# EAGLE board SM2000-A (EAGLE 6.5.0), part 1 of 2
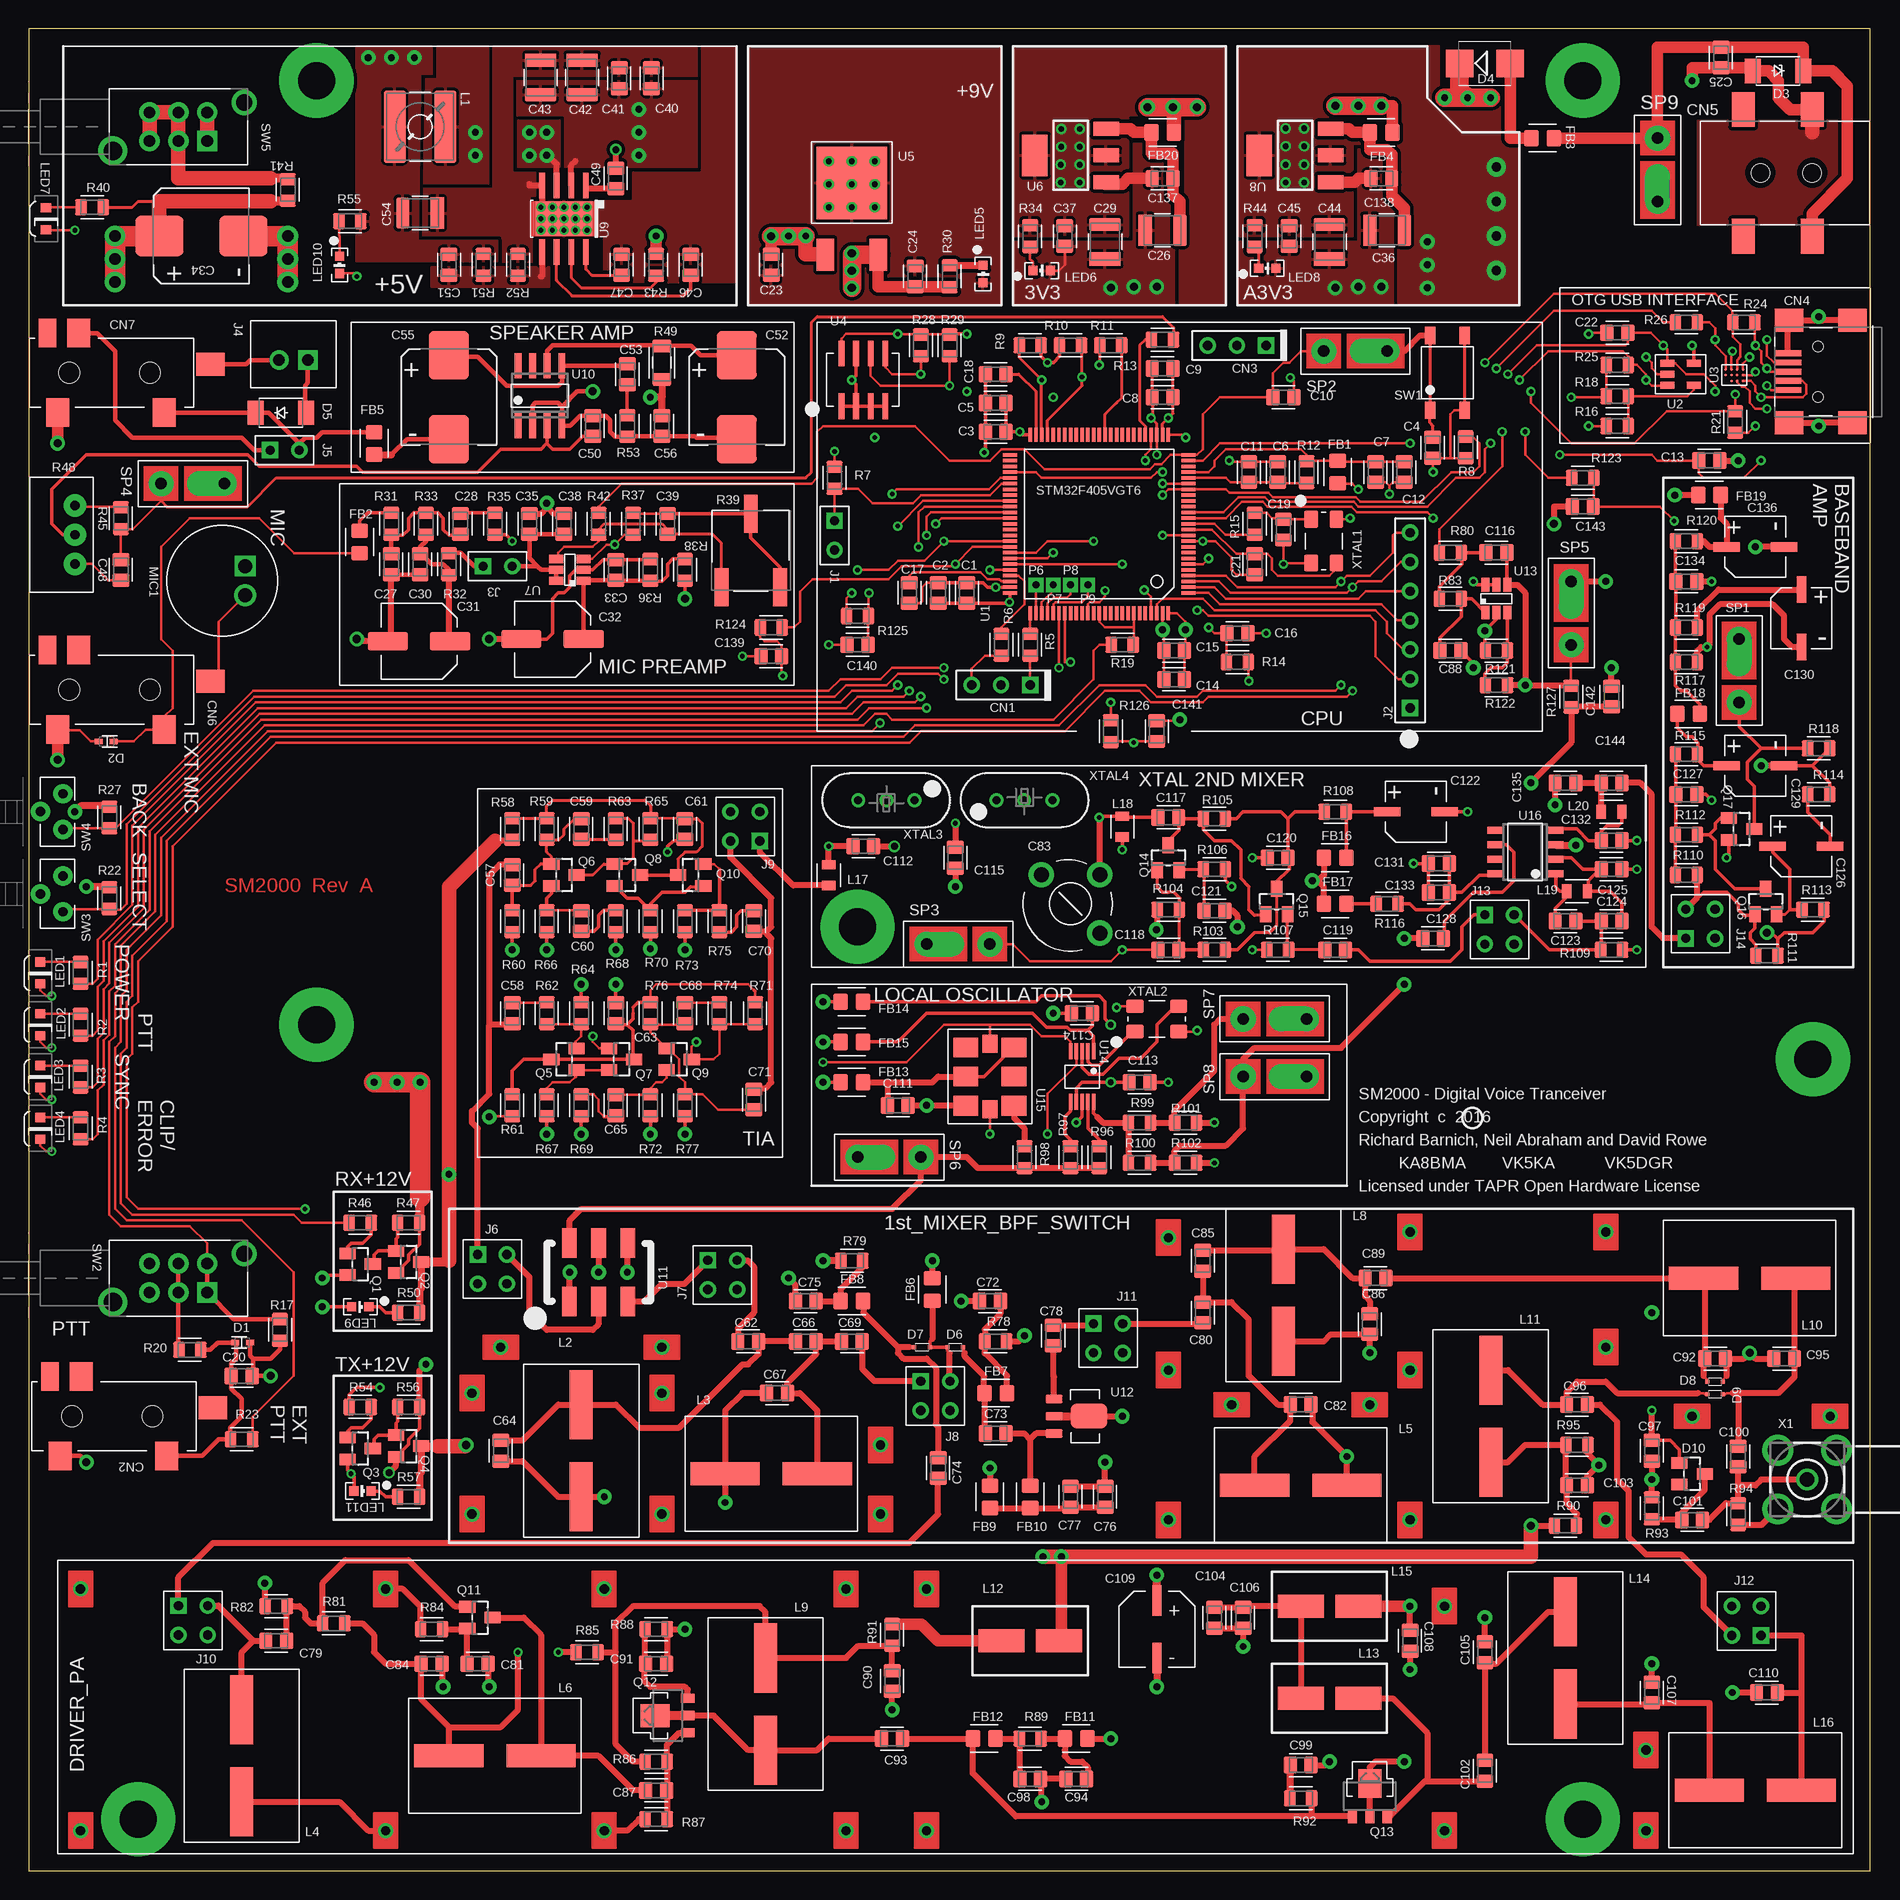
[diagram p7: board, top side]
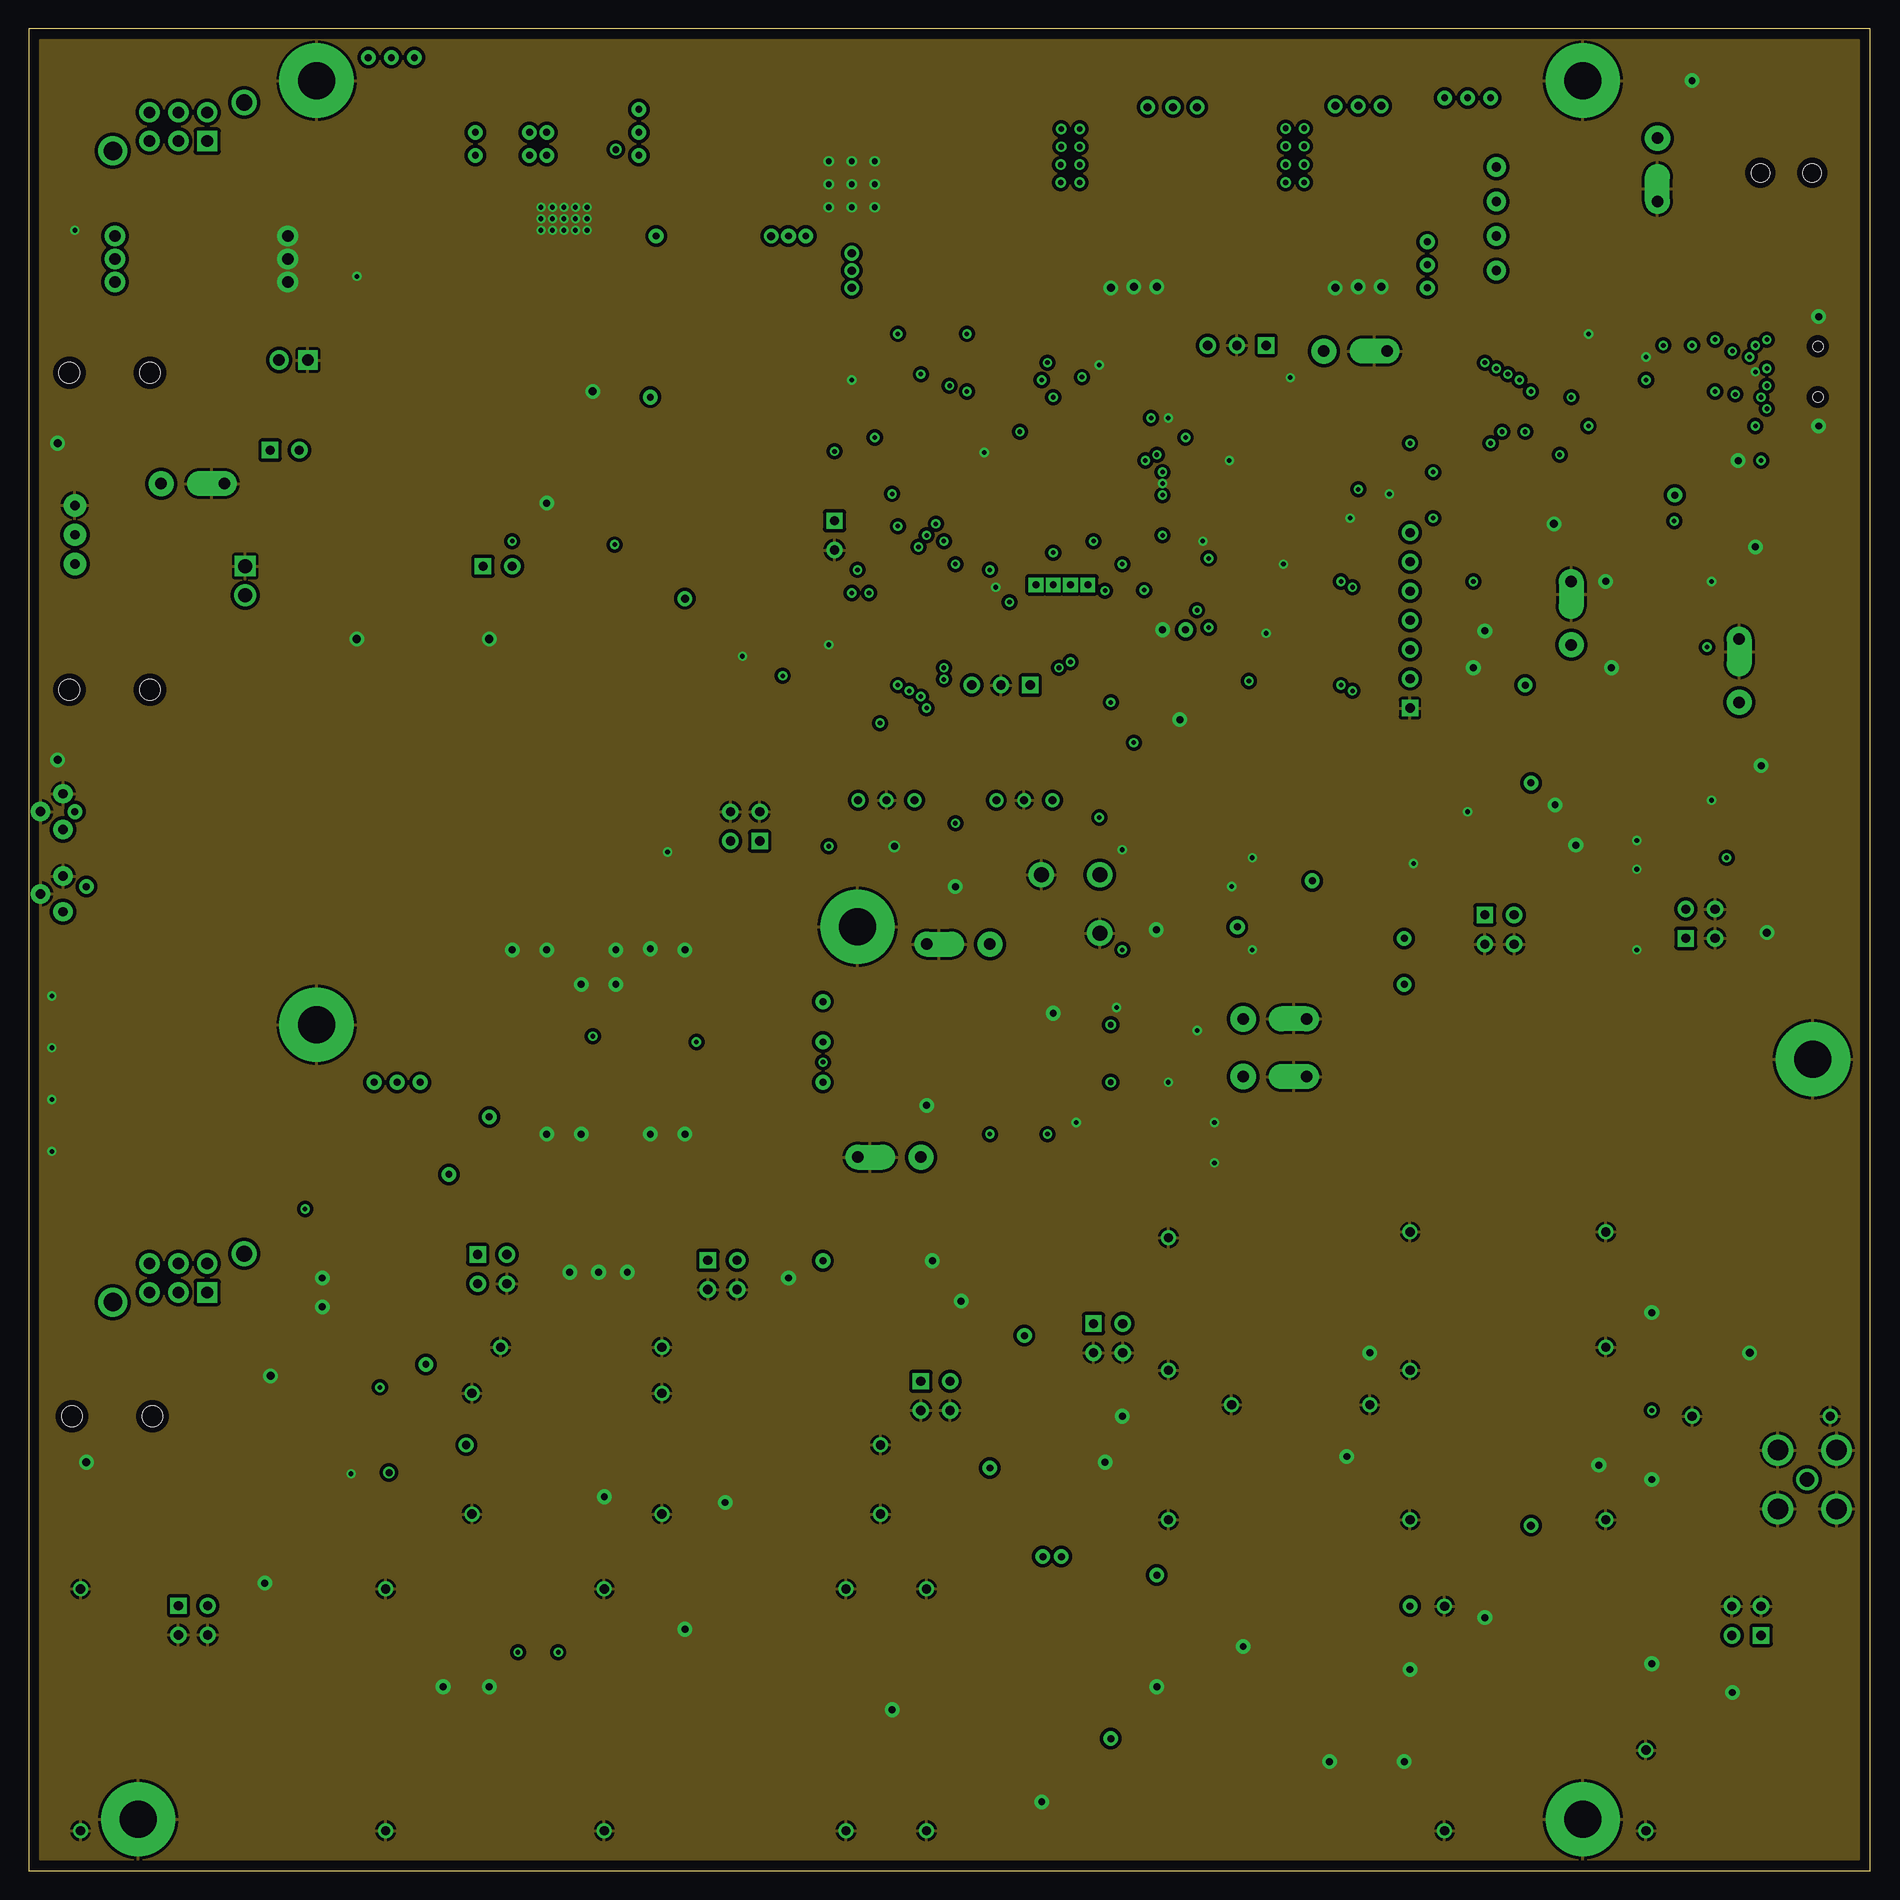
[diagram p8: board, inner layer L2-GND]
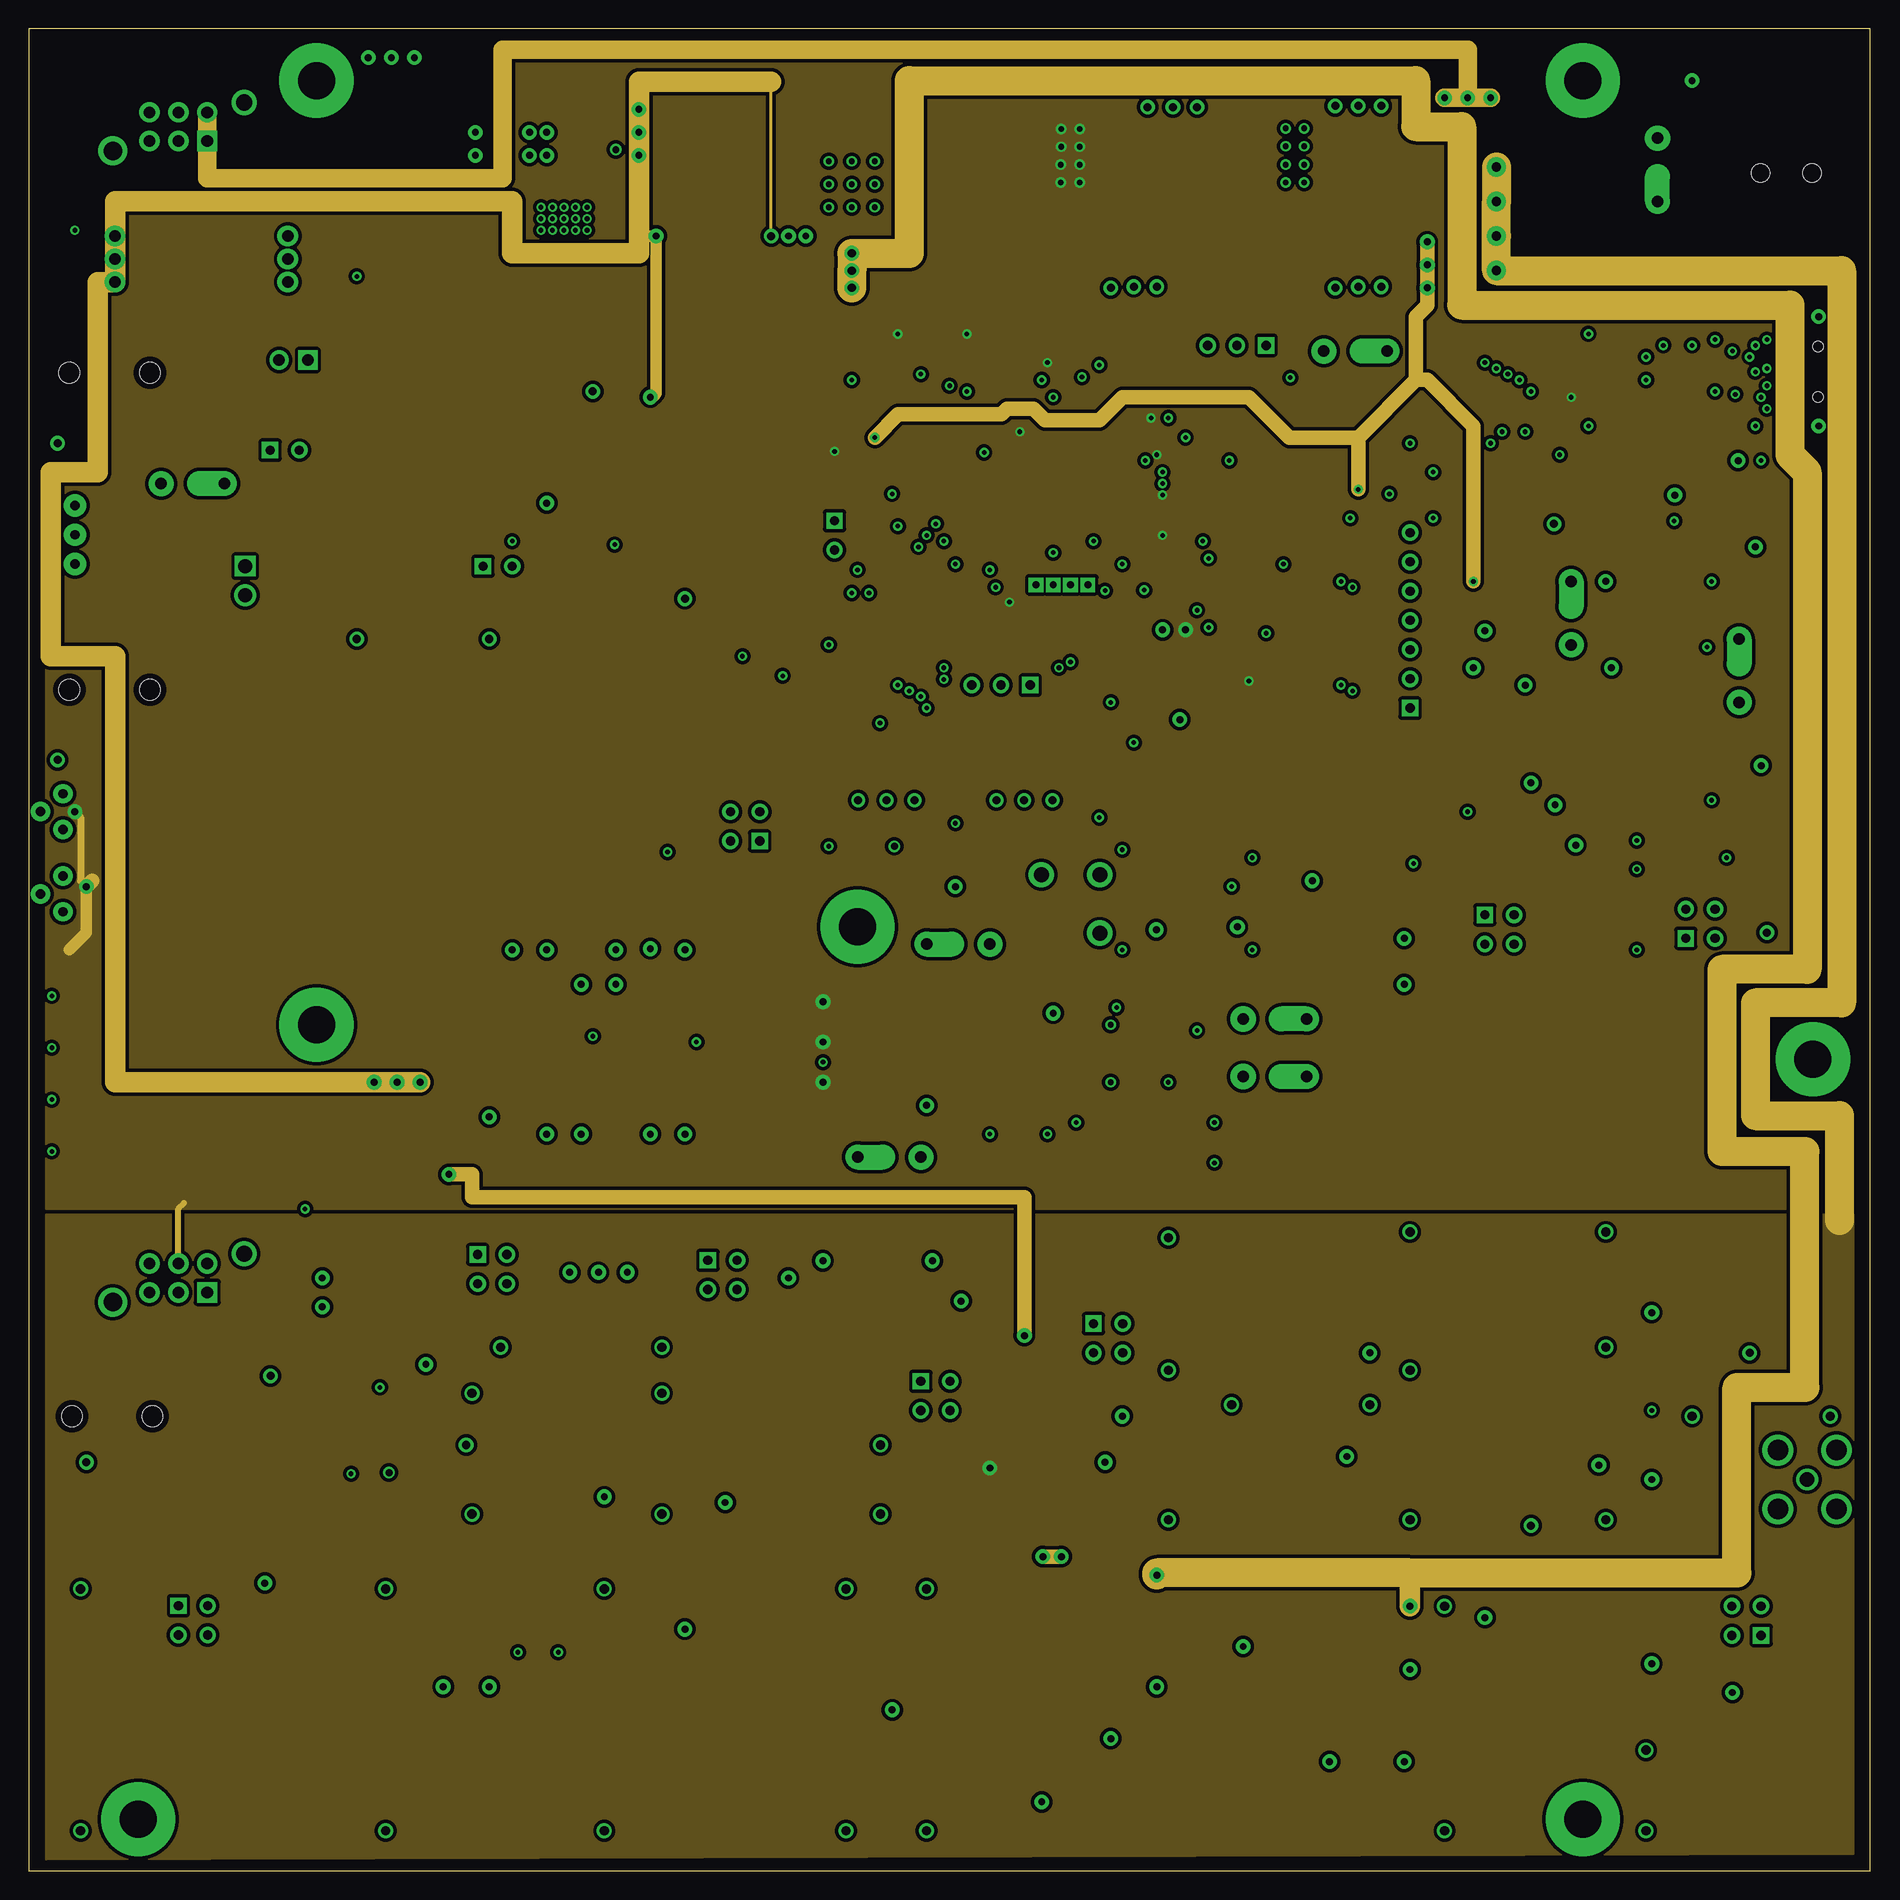
[diagram p9: board, inner layer L3-VDD]
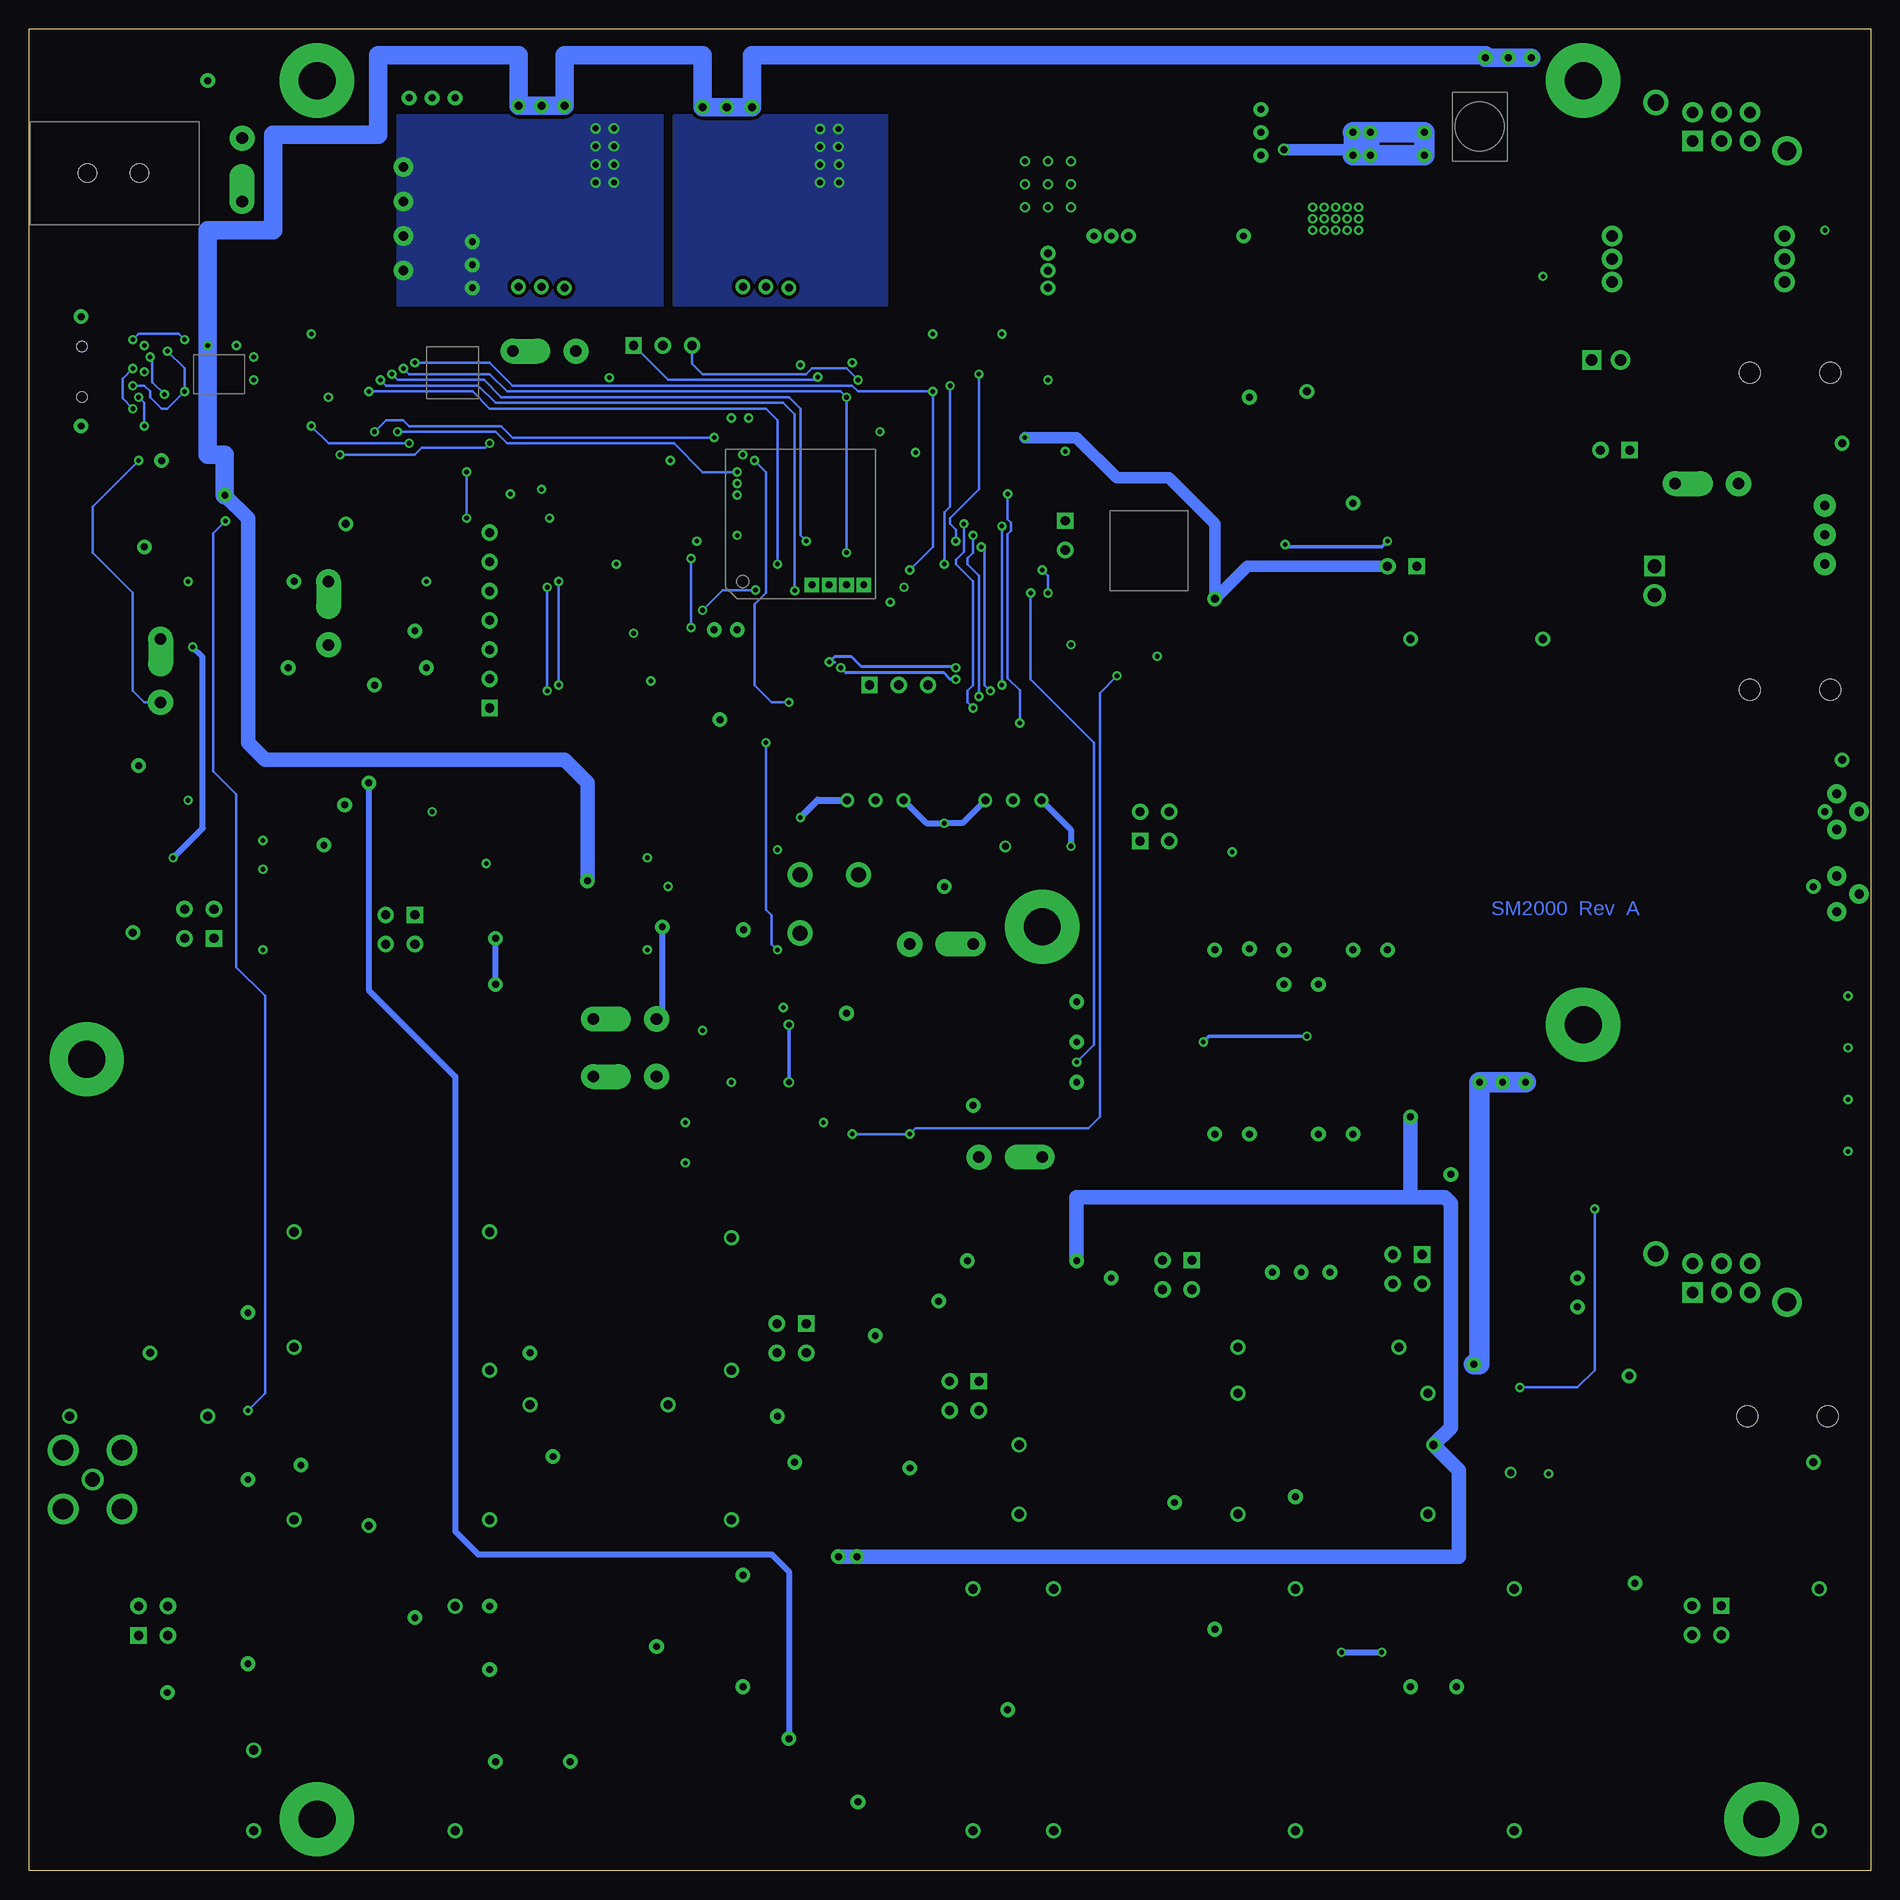
[diagram p10: board, bottom side, seen from below]

Size 160 x 160 mm. Coordinates in mm from the lower left corner, seen from the top.
Outline: 0,0 160,0 160,160 0,160 0,0
Copper layers (1*2+15*16): L1-TOP 0.035mm / dielectric 0.25mm / L2-GND 0.035mm / dielectric 1mm / L3-VDD 0.035mm / dielectric 0.25mm / L4-BOTTOM 0.035mm
Design rules "default *": minimum track width 0.2mm, minimum drill 0.4mm, track to track 0.2mm, track to pad 0.2mm, pad to pad 0.2mm, via to via 0.2mm, smd to smd 0.2mm, copper to edge 0.5mm, drill to drill 0.15mm, minimum pad ring 0.25mm, minimum via ring 0.2mm, stop-mask expansion 0.1mm, vias tented up to drill 0mil, thermal gap 0.25mm
Net classes: 1 Stripline: width 0.508 mm, drill 0.508 mm, clearance 0.508 mm

## Footprints (pad centres in the part's own frame; a part is rotated, then mirrored left to right if it is on the bottom)
C0805 = smd 1.15 x 1.45: 1 -0.9,0; 2 0.9,0
C1210 = smd 1.15 x 2.7: 1 -1.5,0; 2 1.5,0
NICHICON-WX-6.3 = smd 1.6 x 3.5: 1 0,2.7; 2 0,-2.7
CAP-CHEMI-HA0 = smd 3.5 x 4.2: 1 0,3.65; 2 0,-3.65
TRIMCAP_VAR_2222_V = drill 1.3 pad 2.184: R1 -2.54,2.54; R2 2.54,-2.54; S -2.54,-2.54
CAP-CHEMI-F80 = smd 0.8 x 2.65: 1 0,2.5; 2 0,-2.5
NICHICON-WJ-5 = smd 0.8 x 2.3: 1 0,2.5; 2 0,-2.5
HDR100-3 = drill 0.8 pad 1.422 square: 1 0,0 | drill 0.8 pad 1.422: 2 2.54,0; 3 5.08,0
ST-3509 = smd 2 x 2.5: A 4.75,3.45; B 2.95,-3.45; C -4.5,3.45 | smd 2.5 x 2: D -8.5,-0.75 | smd 1.5 x 2.5: F 5.65,-3.45 | hole 1.8: 3.75,0; -3.25,0
JI-MU3-002 = smd 0.5 x 2.3: 1 1.6,-2.85; 2 0.8,-2.85; 3 0,-2.85; 4 -0.8,-2.85; 5 -1.6,-2.85 | smd 2 x 2.5: 6 4.45,-2.75; 7 -4.45,-2.75; 8 4.45,2.75; 9 -4.45,2.75 | hole 0.9: -2.2,-0.25; 2.2,-0.25
DS-0518 = smd 2 x 3: 1 -3,5.5; 2 -3,-5.5; 3 3,-5.5; 4 3,5.5 | hole 1.6: -3,0; 1.5,0
SOD523 = smd 0.7 x 0.5: A 0.7,0; C -0.6,0
SOD128 = smd 1.4 x 2.1: A 2.2,0; C -2.2,0
SMB = smd 2.4 x 2.4: A 2.2,0; C -2.2,0
SC79_INFINEON = smd 0.35 x 0.35: A 0.675,0; C -0.675,0
SOT23 = smd 1 x 1.4: 1 -0.95,-1.1; 2 0.95,-1.1; 3 0,1.1
FE0805 = smd 1.28 x 1.47: 1 -0.975,0; 2 0.975,0
JMPR-2PIN = drill 0.8 pad 1.422 square: 1 0,1.27 | drill 0.8 pad 1.422: 2 0,-1.27
HDR100-7 = drill 0.8 pad 1.422 square: 1 0,0 | drill 0.8 pad 1.422: 2 2.54,0; 3 5.08,0; 4 7.62,0; 5 10.16,0; 6 12.7,0; 7 15.24,0
CONN-BOOM-XH-2A = drill 1 pad 1.676 square: 1 -1.25,0 | drill 1 pad 1.676: 2 1.25,0
JMPR-2X2X.1 = drill 0.8 pad 1.422 square: 1 2.54,0 | drill 0.8 pad 1.422: 2 2.54,-2.54; 3 0,0; 4 0,-2.54
SRR5028 = smd 1.9 x 6.3: 1 -2.2,0; 2 2.2,0
L10X15 = smd 2 x 6: 1 0,4; 2 0,-4
Z15/4 = smd 4 x 2: 1 -2.5,0; 2 2.5,0
L-TDK-MLF2012 = smd 1.2 x 0.8: P$1 0,0.9; P$2 0,-0.9
LTST-S2200K = smd 0.9 x 0.8: A 0,0.95; C 0,-0.95
SML-LX0603SRW = smd 0.8 x 0.8: A 0.75,0; C -0.75,0
CMA-4544PF-W = drill 1.2 pad 1.93: 1 -2,1.27 | drill 1.2 square: 2 -2,-1.27
TPAD50 = drill 0.6 pad 1.27 square: 1 0,0
MTG-PAD-3.2 = drill 3.2 pad 6.452: P$1 0,0
SOT89 = smd 0.8 x 1.2: 1 -1.499,-1.75; 2 0.001,-1.75; 3 1.499,-1.75 | smd 2 x 2.5: 4 0,1.1
R0805 = smd 1.05 x 1.4: 1 -0.95,0; 2 0.95,0
POT3361 = smd 1.19 x 3.3: 1 -2.54,-3.2; 2 0,3.2; 3 2.54,-3.2
POT-3310C = drill 0.8 pad 1.93: 1 -3.91,-2.54; 2 -3.91,0; 3 -3.91,2.54
R1206 = smd 1.1 x 1.7: 1 -1.45,0; 2 1.45,0
SGND = drill 0.8: 1 0,0
SCOPE_PAD = drill 1 pad 2.184: 1 0,1.5 | drill 1 pad 2.184 offset: 2 0,-4
TS-02B = smd 1.5 x 0.9: 1 -3.25,1.5; 2 3.25,1.5; 3 -3.25,-1.5; 4 3.25,-1.5
SW-LC2259 = drill 1 pad 1.778 square: 1 2.5,-1.25 | drill 1 pad 1.778: 2 0,-1.25; 3 -2.5,-1.25; 4 2.5,1.25; 5 0,1.25; 6 -2.5,1.25 | drill 1.6 pad 2.54: 7 -5.7,-2.1 | drill 1.4 pad 2.184: 8 5.7,2.1
TS-026 = drill 0.8 pad 1.676: 1 -1.55,-0.975; 2 1.55,-0.975; 3 0,0.975
LQFP100-14 = smd 0.3 x 1.2: 1 -6,-7.75; 2 -5.5,-7.75; 3 -5,-7.75; 4 -4.5,-7.75; 5 -4,-7.75; 6 -3.5,-7.75; 7 -3,-7.75; 8 -2.5,-7.75; 9 -2,-7.75; 10 -1.5,-7.75; 11 -1,-7.75; 12 -0.5,-7.75; 13 0,-7.75; 14 0.5,-7.75; 15 1,-7.75; 16 1.5,-7.75; 17 2,-7.75; 18 2.5,-7.75; 19 3,-7.75; 20 3.5,-7.75; 21 4,-7.75; 22 4.5,-7.75; 23 5,-7.75; 24 5.5,-7.75; 25 6,-7.75; 51 6,7.75; 52 5.5,7.75; 53 5,7.75; 54 4.5,7.75; 55 4,7.75; 56 3.5,7.75; 57 3,7.75; 58 2.5,7.75; 59 2,7.75; 60 1.5,7.75; 61 1,7.75; 62 0.5,7.75; 63 0,7.75; 64 -0.5,7.75; 65 -1,7.75; 66 -1.5,7.75; 67 -2,7.75; 68 -2.5,7.75; 69 -3,7.75; 70 -3.5,7.75; 71 -4,7.75; 72 -4.5,7.75; 73 -5,7.75; 74 -5.5,7.75; 75 -6,7.75 | smd 1.2 x 0.3: 26 7.75,-6; 27 7.75,-5.5; 28 7.75,-5; 29 7.75,-4.5; 30 7.75,-4; 31 7.75,-3.5; 32 7.75,-3; 33 7.75,-2.5; 34 7.75,-2; 35 7.75,-1.5; 36 7.75,-1; 37 7.75,-0.5; 38 7.75,0; 39 7.75,0.5; 40 7.75,1; 41 7.75,1.5; 42 7.75,2; 43 7.75,2.5; 44 7.75,3; 45 7.75,3.5; 46 7.75,4; 47 7.75,4.5; 48 7.75,5; 49 7.75,5.5; 50 7.75,6; 76 -7.75,6; 77 -7.75,5.5; 78 -7.75,5; 79 -7.75,4.5; 80 -7.75,4; 81 -7.75,3.5; 82 -7.75,3; 83 -7.75,2.5; 84 -7.75,2; 85 -7.75,1.5; 86 -7.75,1; 87 -7.75,0.5; 88 -7.75,0; 89 -7.75,-0.5; 90 -7.75,-1; 91 -7.75,-1.5; 92 -7.75,-2; 93 -7.75,-2.5; 94 -7.75,-3; 95 -7.75,-3.5; 96 -7.75,-4; 97 -7.75,-4.5; 98 -7.75,-5; 99 -7.75,-5.5; 100 -7.75,-6
SOT23-5L = smd 0.6 x 1.2: 1 0.95,1.15; 2 0,1.15; 3 -0.95,1.15; 4 -0.95,-1.15; 5 0.95,-1.15
ECOPACK-11 = smd 0.25 x 0.25: A2 0,0.75; A3 0.5,0.75; B1 -0.5,0.25; B2 0,0.25; B3 0.5,0.25; C1 -0.5,-0.25; C2 0,-0.25; C3 0.5,-0.25; D1 -0.5,-0.75; D2 0,-0.75; D3 0.5,-0.75
SOIC8 = smd 0.5 x 2.25: 1 -1.9,-2.3; 2 -0.63,-2.3; 3 0.64,-2.3; 4 1.91,-2.3; 5 1.91,2.3; 6 0.64,2.3; 7 -0.63,2.3; 8 -1.9,2.3
DPAK = smd 1.5 x 2.8: 1 -2.3,-3.125; 3 2.3,-3.125 | smd 6.1 x 6.3: 4 0,3.125
SOT223 = smd 1.219 x 2.235: 1 -2.311,-3.099; 2 0,-3.099; 3 2.311,-3.099 | smd 3.6 x 2.2: 4 0,3.099
SOT23-6 = smd 0.7 x 1.2: 1 -0.95,-1.2; 2 0,-1.2; 3 0.95,-1.2; 4 0.95,1.2; 5 0,1.2; 6 -0.95,1.2
PSO-DDA = smd 2.2 x 0.5: 1 -2.875,1.905; 2 -2.875,0.635; 3 -2.875,-0.635; 4 -2.875,-1.905; 5 2.875,-1.905; 6 2.875,-0.635; 7 2.875,0.635; 8 2.875,1.905 | smd 2.95 x 4.9: EP 0,0
SO08 = smd 0.6 x 2.2: 1 -1.905,-2.6; 2 -0.635,-2.6; 3 0.635,-2.6; 4 1.905,-2.6; 5 1.905,2.6; 6 0.635,2.6; 7 -0.635,2.6; 8 -1.905,2.6
ADE-1 = smd 1.27 x 2.54: 1 -2.54,-2.54; 2 0,-2.54; 3 2.54,-2.54; 4 2.54,2.54; 5 0,2.54; 6 -2.54,2.54
DF782 = smd 0.711 x 1.473: 1 -1.499,-1.918; 2 0,-1.918; 3 1.499,-1.918 | smd 2.159 x 3.175: 4 0,1.092
MSOP10 = smd 0.3 x 1.4: 1 -1,-2.2; 2 -0.5,-2.2; 3 0,-2.2; 4 0.5,-2.2; 5 1,-2.2; 6 1,2.2; 7 0.5,2.2; 8 0,2.2; 9 -0.5,2.2; 10 -1,2.2
SI570 = smd 1.7 x 2.15: 1 -2.54,-2.1; 2 0,-2.1; 3 2.54,-2.1; 4 2.54,2.1; 5 0,2.1; 6 -2.54,2.1 | smd 1.545 x 1.3: 7 -2.853,0; 8 2.853,0
SO-08 = smd 0.6 x 1.3: 1 -1.905,-2.65; 2 -0.635,-2.65; 3 0.635,-2.65; 4 1.905,-2.65; 5 1.905,2.65; 6 0.635,2.65; 7 -0.635,2.65; 8 -1.905,2.65
BU-SMA-H = drill 1.27: 1 0,0 | drill 1.778: 2 -2.55,2.55; 3 2.55,2.55; 4 2.55,-2.55; 5 -2.55,-2.55
CTS-405 = smd 1.5 x 1.2: 1 -1.9,-1.1; 2 1.9,-1.1; 3 1.9,1.1; 4 -1.9,1.1
HC49U = drill 0.7 pad 1.2: 1 -2.44,0; 2 -0.027,0; 3 2.44,0

## Placement (x,y rotation side)
C1  100nF,25V  [C0805]  81.5,111 90 top
C2  10nF,25V  [C0805]  79,111 90 top
C3  100nF,25V  [C0805]  84,125 180 top
C4  100nF,25V  [C0805]  121.96,123.61 90 top
C5  10nF,25V  [C0805]  84,127.5 180 top
C6  1uF,25V  [C0805]  108.5,121.5 90 top
C7  1uF,25V  [C0805]  117,121.5 270 top
C8  100nF,25V  [C0805]  98.5,128 0 top
C9  10nF,25V  [C0805]  98.5,130.5 0 top
C10  1nF,25V  [C0805]  109,128 0 top
C11  100nF,25V  [C0805]  106,121.5 90 top
C12  100nF,25V  [C0805]  119.5,121.5 270 top
C13  TBD  [C0805]  146,122.5 0 top
C14  100nF,25V  [C0805]  99.5,103.5 180 top
C15  10nF,25V  [C0805]  99.5,106 180 top
C16  1uF,25V  [C0805]  105,107.5 0 top
C17  2.2uF,25V  [C0805]  76.5,111 270 top
C18  2.2uF,25V  [C0805]  84,130 180 top
C19  20pF,50V  [C0805]  109,116.5 270 top
C20  100nF,25V  [C0805]  18.5,43 0 top
C21  20pF,50V  [C0805]  106.5,113.5 270 top
C22  4.7uF,25V  [C0805]  138,133.6 180 top
C23  .33uF,25V  [C0805]  64.5,139.5 270 top
C24  100nF,25V  [C0805]  77,138.5 90 top
C25  10nF,25V  [C0805]  147,157.5 270 top
C26  22uF,25V  [C1210]  98.5,142.5 180 top
C27  1nF,25V  [C0805]  31.5,113.5 270 top
C28  220nF,25V  [C0805]  37.5,117 90 top
C29  22uF,25V  [C1210]  93.5,141.5 270 top
C30  100nF,25V  [C0805]  34,113.5 270 top
C31  100uF,6.3V,EL  [NICHICON-WX-6.3]  33.91,106.81 270 top
C32  100uF,6.3V,EL  [NICHICON-WX-6.3]  45.5,107 270 top
C33  100nF,25V  [C0805]  51,113 270 top
C34  220uF,25V  [CAP-CHEMI-HA0]  15,142 90 top
C35  100nF,25V  [C0805]  43.5,117 90 top
C36  22uF,25V  [C1210]  118,142.5 180 top
C37  100nF,25V  [C0805]  90,142 270 top
C38  2.2uF,25V  [C0805]  46.5,117 90 top
C39  100pF,50V  [C0805]  55.5,117 270 top
C40  1nF,25V  [C0805]  54.1,155.7 90 top
C41  100nF,25V  [C0805]  51.3,155.7 90 top
C42  22uF,25V  [C1210]  48.07,155.77 90 top
C43  22uF,25V  [C1210]  44.47,155.77 90 top
C44  22uF,25V  [C1210]  113,141.5 270 top
C45  100nF,25V  [C0805]  109.5,142 270 top
C46  470nF,25V  [C0805]  57.5,139.5 90 top
C47  8.2nF,25V  [C0805]  51.5,139.5 90 top
C48  100nF,25V  [C0805]  8,113 270 top
C49  100nF,25V  [C0805]  51,147 90 top
C50  3.9nF,25V  [C0805]  49,125.5 90 top
C51  20pF,50V  [C0805]  36.5,139.5 270 top
C52  220uF,25V  [CAP-CHEMI-HA0]  61.5,128 0 top
C53  47nF,25V  [C0805]  52,130 270 top
C54  22uF,25V  [C1210]  34,144 0 top
C55  220uF,25V  [CAP-CHEMI-HA0]  36.5,128 0 top
C56  100nF,25V  [C0805]  55,125.5 270 top
C57  100nF,25V  [C0805]  42,86.5 90 top
C58  100nF,25V  [C0805]  42,74.5 90 top
C59  100nF,25V  [C0805]  48,90.5 90 top
C60  100nF,25V  [C0805]  48,82.5 270 top
C61  100nF,25V  [C0805]  57,90.5 270 top
C62  3.3pF,50V  [C0805]  62.5,46 180 top
C63  100nF,25V  [C0805]  51,74.5 90 top
C64  12pF,50V  [C0805]  41,36.5 270 top
C65  100nF,25V  [C0805]  51,66.5 270 top
C66  0.5pF,50V  [C0805]  67.5,46 180 top
C67  12pF,50V  [C0805]  65,41.5 0 top
C68  100nF,25V  [C0805]  57,74.5 270 top
C69  3.3pF,50V  [C0805]  71.5,46 180 top
C70  100nF,25V  [C0805]  63,82.5 90 top
C71  100nF,25V  [C0805]  63,67 90 top
C72  1nF,25V  [C0805]  83.5,49.5 180 top
C73  1nF,25V  [C0805]  84,38 0 top
C74  1nF,25V  [C0805]  79,35 270 top
C75  1nF,25V  [C0805]  67.5,49.5 180 top
C76  1nF,25V  [C0805]  93.5,32.5 90 top
C77  1uF,25V  [C0805]  90.5,32.5 90 top
C78  1nF,25V  [C0805]  89,46.5 90 top
C79  22pF,50V  [C0805]  21.5,20 180 top
C80  3.3pF,50V  [C0805]  102,48.5 270 top
C81  1nF,25V  [C0805]  39,18 0 top
C82  12pF,50V  [C0805]  110.5,40.5 0 top
C83  2-12pF  [TRIMCAP_VAR_2222_V]  90.5,84 180 top
C84  100nF,25V  [C0805]  35,18 0 top
C85  0.5pF,50V  [C0805]  102,53 270 top
C86  12pF,50V  [C0805]  116.5,47.5 90 top
C87  5.6pF,50V  [C0805]  54.5,7 180 top
C88  8.2nF,25V  [C0805]  123.5,106 0 top
C89  3.3pF,50V  [C0805]  117,51.5 180 top
C90  100nF,25V  [C0805]  75,16.5 270 top
C91  1nF,25V  [C0805]  54.5,18 0 top
C92  22pF,50V  [C0805]  146.5,44.5 0 top
C93  22pF,50V  [C0805]  75,11.5 180 top
C94  100nF,25V  [C0805]  91,8 180 top
C95  22pF,50V  [C0805]  152.5,44.5 180 top
C96  1nF,25V  [C0805]  134.5,40.5 0 top
C97  1nF,25V  [C0805]  141,36.5 90 top
C98  1nF,25V  [C0805]  87,8 0 top
C99  1nF,25V,DNL  [C0805]  110.5,9.2 0 top
C100  1nF,25V  [C0805]  148.5,36 90 top
C101  1pF,50V  [C0805]  144.5,30.5 0 top
C102  1nF,25V  [C0805]  126.5,8.7 90 top
C103  1nF,25V  [C0805]  134.5,33.5 0 top
C104  100nF,25V  [C0805]  103,22 270 top
C105  33pF,50V  [C0805]  126.5,19 90 top
C106  1nF,25V  [C0805]  105.5,22 270 top
C107  47pF,50V  [C0805]  141,15.5 90 top
C108  100nF,25V  [C0805]  120,20 270 top
C109  100uF,25V,EL  [CAP-CHEMI-F80]  98,21 0 top
C110  33pF,50V  [C0805]  151,15.5 180 top
C111  100nF,25V  [C0805]  75.5,66.5 0 top
C112  39pF,50V  [C0805]  72.5,89 0 top
C113  100nF,25V  [C0805]  96.5,68.5 0 top
C114  100nF,25V  [C0805]  91.5,74.5 180 top
C115  5.6pF,50V  [C0805]  80.5,88 270 top
C116  8.2nF,25V  [C0805]  127.5,114.5 0 top
C117  100nF,25V  [C0805]  99,91.5 0 top
C118  100nF,25V  [C0805]  99,80 180 top
C119  100nF,25V  [C0805]  113.5,80 0 top
C120  100nF,25V  [C0805]  108.5,88 180 top
C121  100nF,25V  [C0805]  103,83.4 0 top
C122  10uF,25V,EL  [NICHICON-WJ-5]  120.5,92 90 top
C123  27pF,50V  [C0805]  133.5,82.5 180 top
C124  150pF,50V  [C0805]  137.5,82.5 180 top
C125  100nF,25V  [C0805]  137.5,87 180 top
C126  10uF,25V,EL  [NICHICON-WJ-5]  154,89 90 top
C127  100nF,25V  [C0805]  144,93.5 0 top
C128  150pF,50V  [C0805]  122,81 0 top
C129  10uF,25V,EL  [NICHICON-WJ-5]  150,96 90 top
C130  10uF,25V,EL  [NICHICON-WJ-5]  154,108.8 0 top
C131  1nF,25V  [C0805]  122.5,87.5 0 top
C132  1nF,25V  [C0805]  137.5,89.5 180 top
C133  100nF,25V  [C0805]  122.5,85 0 top
C134  100nF,25V  [C0805]  144,112 0 top
C135  1nF,25V  [C0805]  133.5,94.5 0 top
C136  10uF,25V,EL  [NICHICON-WJ-5]  150,115 90 top
C137  100nF,25V  [C0805]  98.5,147 180 top
C138  100nF,25V  [C0805]  117.5,147 180 top
C139  TBD  [C0805]  64.5,105.5 180 top
C140  TBD  [C0805]  72,106.5 180 top
C141  TBD  [C0805]  98,99 90 top
C142  TBD  [C0805]  137.5,102 90 top
C143  TBD  [C0805]  135,118.5 180 top
C144  100nF,25V  [C0805]  137.5,94.5 180 top
CN1  HDR100-3  [HDR100-3]  87,103 180 top
CN2  ST-3509  [ST-3509]  7.5,39.5 180 top
CN3  HDR100-3  [HDR100-3]  107.5,132.5 180 top
CN4  JS-MU3-002  [JI-MU3-002]  155.68,130.22 270 top
CN5  DS-0518  [DS-0518]  151.93,147.48 180 top
CN6  ST-3509  [ST-3509]  7.28,102.59 180 top
CN7  ST-3509  [ST-3509]  7.28,130.12 180 top
D1  DNL  [SOD523]  18.54,45.9 0 top
D2  DNL  [SOD523]  6.77,98.1 180 top
D3  PTVS20VP1UP  [SOD128]  151.97,156.34 180 top
D4  B330B  [SMB]  126.5,157 0 top
D5  DNL  [SOD128]  21.91,126.66 0 top
D6  BAR64-02V  [SC79_INFINEON]  80.5,45.5 0 top
D7  BAR64-02V  [SC79_INFINEON]  77.6,45.5 180 top
D8  BAR64-02V  [SC79_INFINEON]  146.5,42.5 180 top
D9  BAR64-02V  [SC79_INFINEON]  146.5,41.4 180 top
D10  BAT18  [SOT23]  144.5,34.5 270 top
DRILEGEND  [DRILEGEND]  19.31,-33.33 0 top  (outside the outline)
FB1  FB0805  [FE0805]  113.7,121.5 90 top
FB2  FB0805  [FE0805]  28.75,115.43 90 top
FB3  FB0805  [FE0805]  131.5,150.5 180 top
FB4  FB0805  [FE0805]  117.5,151 180 top
FB5  FB0805  [FE0805]  30,124 90 top
FB6  FB0805  [FE0805]  78.5,50.5 270 top
FB7  FB0805  [FE0805]  84,41.5 0 top
FB8  FB0805  [FE0805]  71.5,49.5 0 top
FB9  FB0805  [FE0805]  83.5,32.5 90 top
FB10  FB0805  [FE0805]  87,32.5 270 top
FB11  FB0805  [FE0805]  91,11.5 180 top
FB12  FB0805  [FE0805]  83,11.5 180 top
FB13  FB0805  [FE0805]  71.5,68.5 0 top
FB14  FB0805  [FE0805]  71.5,75.5 0 top
FB15  FB0805  [FE0805]  71.5,72 0 top
FB16  FB0805  [FE0805]  113.5,88 180 top
FB17  FB0805  [FE0805]  113.5,84 0 top
FB18  FB0805  [FE0805]  144.2,100.5 0 top
FB19  FB0805  [FE0805]  146,119.5 180 top
FB20  FB0805  [FE0805]  98.5,151 180 top
J1  JMP-2PIN  [JMPR-2PIN]  70,116 0 top
J2  HDR100-7  [HDR100-7]  120,101 90 top
J3  JMP-2PIN  [JMPR-2PIN]  40.73,113.32 90 top
J4  CONN-BOOM-XH-2A  [CONN-BOOM-XH-2A]  23,131.23 180 top
J5  JMP-2PIN  [JMPR-2PIN]  22.23,123.4 90 top
J6  JMPR-2X2  [JMPR-2X2X.1]  39,51 90 top
J7  JMPR-2X2  [JMPR-2X2X.1]  59,50.5 90 top
J8  JMPR-2X2  [JMPR-2X2X.1]  77.5,40 90 top
J9  JMPR-2X2  [JMPR-2X2X.1]  63.5,92 270 top
J10  JMPR-2X2  [JMPR-2X2X.1]  13,20.5 90 top
J11  JMPR-2X2  [JMPR-2X2X.1]  92.5,45 90 top
J12  JMPR-2X2  [JMPR-2X2X.1]  150.5,23 270 top
J13  JMPR-2X2  [JMPR-2X2X.1]  126.5,80.5 90 top
J14  JMPR-2X2  [JMPR-2X2X.1]  146.5,81 180 top
L1  4.2uH  [SRR5028]  34,151.5 180 top
L2  68nH  [L10X15]  48,36.5 0 top
L3  68nH  [L10X15]  64.5,34.5 270 top
L4  57nH  [L10X15]  18.5,10 0 top
L5  68nH  [L10X15]  110.5,33.5 90 top
L6  168nH  [L10X15]  40.5,10 90 top
L8  68nH  [L10X15]  109,50 0 top
L9  54nH  [L10X15]  64,14.5 0 top
L10  53nH 3T 5mm ID  [L10X15]  149.5,51.5 90 top
L11  220nH  [L10X15]  127,39.5 180 top
L12  RFC  [Z15/4]  87,20 180 top
L13  RFC  [Z15/4]  113,15 0 top
L14  57nH  [L10X15]  133.5,18.5 0 top
L15  RFC  [Z15/4]  113,23 0 top
L16  57nH  [L10X15]  150,7 90 top
L17  5.7uH  [L-TDK-MLF2012]  69.5,86.5 180 top
L18  L-TDK-MLF-2012-9.2uH  [L-TDK-MLF2012]  95,90.7 0 top
L19  5.2uH  [L-TDK-MLF2012]  134.5,85.1 90 top
L20  15uH,TDK,MLF  [L-TDK-MLF2012]  137.5,92 270 top
LED1  LTST-S220KGKT  [LTST-S2200K]  1,78 0 top
LED2  LTST-S220KRKT  [LTST-S2200K]  1,73.5 0 top
LED3  LTST-S220KGKT  [LTST-S2200K]  1,69 0 top
LED4  LTST-S220KRKT  [LTST-S2200K]  1,64.5 0 top
LED5  SML-LX0603GW  [SML-LX0603SRW]  82.9,138.7 90 top
LED6  SML-LX0603GW  [SML-LX0603SRW]  88,139 180 top
LED7  LTST-S220KGKT  [LTST-S2200K]  1.5,143.5 0 top
LED8  SML-LX0603GW  [SML-LX0603SRW]  107.6,139.2 180 top
LED9  SML-LX0603SRW  [SML-LX0603SRW]  28.8,49 0 top
LED10  SML-LX0603GW  [SML-LX0603SRW]  27,139.5 90 top
LED11  SML-LX0603YW  [SML-LX0603SRW]  29,33 0 top
MIC1  CMA-4544PF-W  [CMA-4544PF-W]  16.8,112.06 180 top
P6  TPAD50  [TPAD50]  87.5,111.7 0 top
P7  TPAD50  [TPAD50]  89,111.7 0 top
P8  TPAD50  [TPAD50]  90.5,111.7 0 top
P9  TPAD50  [TPAD50]  92,111.7 0 top
PAD1  MTG-PAD-3.2  [MTG-PAD-3.2]  25,155.5 0 top
PAD2  MTG-PAD-3.2  [MTG-PAD-3.2]  135,155.5 0 top
PAD3  MTG-PAD-3.2  [MTG-PAD-3.2]  25,73.5 0 top
PAD4  MTG-PAD-3.2  [MTG-PAD-3.2]  72,82 0 top
PAD5  MTG-PAD-3.2  [MTG-PAD-3.2]  155,70.5 0 top
PAD6  MTG-PAD-3.2  [MTG-PAD-3.2]  9.5,4.5 0 top
PAD7  MTG-PAD-3.2  [MTG-PAD-3.2]  135,4.5 0 top
PCB1  SM2000A  [NOPACKAGE]  -1,1 0 top
Q1  MMBT3904  [SOT23]  28.8,52.7 270 top
Q2  STR2P3LLH6  [SOT23]  33,52.9 270 top
Q3  MMBT3904  [SOT23]  28.8,36.7 270 top
Q4  STR2P3LLH6  [SOT23]  33,36.9 270 top
Q5  MMBT3904  [SOT23]  46.5,70.5 90 top
Q6  MMBT3904  [SOT23]  46.5,86.5 270 top
Q7  MMBT3904  [SOT23]  51.5,70.5 270 top
Q8  MMBT3904  [SOT23]  52,86.5 270 top
Q9  MMBT3904  [SOT23]  56.5,70.5 270 top
Q10  MMBT3904  [SOT23]  57.5,86.5 90 top
Q11  BFR92  [SOT23]  39.2,22 270 top
Q12  BFQ19  [SOT89]  55.5,13.5 90 top
Q13  RD01MUS2  [SOT89]  116.5,6.5 0 top
Q14  MMBT3904  [SOT23]  99,88 0 top
Q15  MMBT3904  [SOT23]  108.4,84.2 0 top
Q16  MMBT3904  [SOT23]  150.9,84.2 0 top
Q17  MMBT3906  [SOT23]  148.8,90.5 270 top
R1  680,1%  [R0805]  4.5,78 90 top
R2  680,1%  [R0805]  4.5,73.5 90 top
R3  680,1%  [R0805]  4.5,69 90 top
R4  680,1%  [R0805]  4.5,64.5 90 top
R5  22,1%  [R0805]  87,106.5 270 top
R6  22,1%  [R0805]  84.5,106.5 270 top
R7  4.7K,1%  [R0805]  70,121 270 top
R8  4.7K,1%  [R0805]  124.83,123.64 270 top
R9  4.7K,1%  [R0805]  87,132.5 180 top
R10  4.7K,1%  [R0805]  90.5,132.5 0 top
R11  1K,1%  [R0805]  94,132.5 0 top
R12  47,1%  [R0805]  111,121.5 270 top
R13  0 Ohm  [R0805]  98.5,133 0 top
R14  0 Ohm  [R0805]  105,105 180 top
R15  220,1%  [R0805]  106.5,117 90 top
R16  0 Ohm  [R0805]  138,125.5 0 top
R17  10K,1%  [R0805]  21.82,46.99 90 top
R18  10K,1%  [R0805]  138,128.1 180 top
R19  470,1%  [R0805]  95,106.5 180 top
R20  10K,1%  [R0805]  14,45.26 0 top
R21  22,1%  [R0805]  148.24,125.85 90 top
R22  10K,1%  [R0805]  7,84.5 90 top
R23  2.2K,1%  [R0805]  18.5,37.5 0 top
R24  22,1%  [R0805]  149,134.5 180 top
R25  47K,1%  [R0805]  138,130.8 0 top
R26  0 Ohm  [R0805]  144,134.5 180 top
R27  10K,1%  [R0805]  7,91.5 90 top
R28  4.7K,1%  [R0805]  77.5,132.5 270 top
R29  4.7K,1%  [R0805]  80,132.5 270 top
R30  1.5K,1%  [R0805]  80,138.5 270 top
R31  100,1%  [R0805]  31.5,117 270 top
R32  100,1%  [R0805]  36.5,113.5 90 top
R33  2.2K,1%  [R0805]  34.5,117 270 top
R34  330,1%  [R0805]  87,142 90 top
R35  2.2K,1%  [R0805]  40.5,117 270 top
R36  2.2K,1%  [R0805]  54,113 90 top
R37  2.2K,1%  [R0805]  52.5,117 90 top
R38  2.2K,1%  [R0805]  57,113 270 top
R39  500K,TrimPOT  [POT3361]  62.72,114.68 0 top
R40  330,1%  [R0805]  5.5,144.5 0 top
R41  0 Ohm  [R0805]  22.5,146 270 top
R42  1.5K,1%  [R0805]  49.5,117 270 top
R43  10K,1%  [R0805]  54.5,139.5 270 top
R44  330,1%  [R0805]  106.5,142 90 top
R45  22.1K,1%  [R0805]  8,117.5 90 top
R46  10K,1%  [R0805]  28.8,56.3 0 top
R47  2.2K,1%  [R0805]  33,56.3 0 top
R48  100K,POT  [POT-3310C]  0.1,116.06 180 top
R49  4.7,0.5W,1206  [R1206]  55,131 90 top
R50  1K,1%  [R0805]  33,48.5 0 top
R51  124.0K,1%  [R0805]  39.5,139.5 270 top
R52  22.1K,1%  [R0805]  42.5,139.5 90 top
R53  10,1%  [R0805]  52,125.5 270 top
R54  10K,1%  [R0805]  28.8,40.3 0 top
R55  680,1%  [R0805]  27.9,143.3 0 top
R56  2.2K,1%  [R0805]  33,40.3 0 top
R57  1K,1%  [R0805]  33,32.5 0 top
R58  10,1%  [R0805]  42,90.5 270 top
R59  10K,1%  [R0805]  45,90.5 90 top
R60  2.2K,1%  [R0805]  42,82.5 90 top
R61  10,1%  [R0805]  42,66.5 90 top
R62  47,1%  [R0805]  45,74.5 90 top
R63  680,1%  [R0805]  51,90.5 90 top
R64  470,1%  [R0805]  48,74.5 270 top
R65  330,1%  [R0805]  54,90.5 270 top
R66  180,1%  [R0805]  45,82.5 90 top
R67  2.2K,1%  [R0805]  45,66.5 90 top
R68  15,1%  [R0805]  51,82.5 90 top
R69  15,1%  [R0805]  48,66.5 90 top
R70  2.2K,1%  [R0805]  54,82.5 90 top
R71  330,1%  [R0805]  63.1,74.5 270 top
R72  180,1%  [R0805]  54,66.5 90 top
R73  470,1%  [R0805]  57,82.5 90 top
R74  680,1%  [R0805]  60,74.5 270 top
R75  47,1%  [R0805]  60,82.5 270 top
R76  10K,1%  [R0805]  54,74.5 90 top
R77  2.2K,1%  [R0805]  57,66.5 90 top
R78  18K,1%  [R0805]  84,46 180 top
R79  18K,1%  [R0805]  71.5,53 0 top
R80  10K,1%  [R0805]  123.5,114.5 0 top
R81  10K,1%  [R0805]  26.5,21.5 0 top
R82  3K,1%  [R0805]  21.5,23 0 top
R83  10K,1%  [R0805]  123.5,110.5 0 top
R84  150,1%  [R0805]  35,21 0 top
R85  10,1%  [R0805]  48.5,19 180 top
R86  3K,1%  [R0805]  54.5,9.5 180 top
R87  1K,1%  [R0805]  54.5,4.5 0 top
R88  49.9,1%  [R0805]  54.5,21 180 top
R89  4.7K,1%  [R0805]  87,11.5 180 top
R90  2.2K,1%  [R0805]  133.5,30 180 top
R91  10,1%  [R0805]  75,20.5 270 top
R92  47,1%, DNL  [R0805]  110.5,6.3 0 top
R93  330,1%  [R0805]  141,31.5 270 top
R94  68K,1%  [R0805]  148.5,31 90 top
R95  10K,1%  [R0805]  134.5,37 180 top
R96  0 Ohm  [R0805]  93,62 90 top
R97  0 Ohm  [R0805]  90.5,62 90 top
R98  0 Ohm  [R0805]  86.5,62 90 top
R99  1K,1%  [R0805]  96.5,65 180 top
R100  1K,1%  [R0805]  96.5,61.5 180 top
R101  150,1%  [R0805]  100.5,65 0 top
R102  150,1%  [R0805]  100.5,61.5 0 top
R103  33K,1%  [R0805]  103,80 0 top
R104  15K,1%  [R0805]  99,83.5 0 top
R105  3K,1%  [R0805]  103,91.4 0 top
R106  1K,1%  [R0805]  103,87 180 top
R107  1K,1%  [R0805]  108.5,80 0 top
R108  10,1%  [R0805]  113.5,92 180 top
R109  49.9,1%  [R0805]  137.5,80 180 top
R110  39K,1%  [R0805]  144,86.5 180 top
R111  18K,1%  [R0805]  151,79.5 180 top
R112  2.2K,1%  [R0805]  144,90 180 top
R113  1K,1%  [R0805]  155,83.5 180 top
R114  100,1%  [R0805]  155.5,93.5 180 top
R115  10,1%  [R0805]  144,97 180 top
R116  150,1%  [R0805]  118,84 180 top
R117  3.3K,1%  [R0805]  144,105 180 top
R118  3.3K,1%  [R0805]  155.5,97.5 180 top
R119  100,1%  [R0805]  144,108 180 top
R120  10,1%  [R0805]  144,115.5 180 top
R121  10K,1%  [R0805]  127.5,106 0 top
R122  10K,1%  [R0805]  127.5,103 0 top
R123  TBD  [R0805]  135,121 0 top
R124  TBD  [R0805]  64.5,108 180 top
R125  TBD  [R0805]  72,109 0 top
R126  TBD  [R0805]  94,99 270 top
R127  TBD  [R0805]  134,102 90 top
S1  SGND  [SGND]  55,31 90 top
S2  SGND  [SGND]  55,41.5 90 top
S3  SGND  [SGND]  137,30.5 90 top
S4  SGND  [SGND]  123,23 90 top
S5  SGND  [SGND]  116.5,40.5 180 top
S6  SGND  [SGND]  120,30.5 90 top
S8  SGND  [SGND]  140.5,10.5 270 top
S9  SGND  [SGND]  4.5,24.5 90 top
S10  SGND  [SGND]  4.5,3.5 90 top
S11  SGND  [SGND]  31,24.5 90 top
S12  SGND  [SGND]  31,3.5 90 top
S14  SGND  [SGND]  50,3.5 90 top
S15  SGND  [SGND]  71,24.5 270 top
S16  SGND  [SGND]  71,3.5 270 top
S17  SGND  [SGND]  78,24.5 90 top
S18  SGND  [SGND]  78,3.5 90 top
S20  SGND  [SGND]  123,3.5 90 top
S21  SGND  [SGND]  41,45.5 180 top
S22  SGND  [SGND]  55,45.5 180 top
S23  SGND  [SGND]  74,31 270 top
S24  SGND  [SGND]  74,37 90 top
S25  SGND  [SGND]  99,30.5 90 top
S26  SGND  [SGND]  50,24.5 90 top
S27  SGND  [SGND]  120,43.5 90 top
S28  SGND  [SGND]  137,45.5 90 top
S29  SGND  [SGND]  137,55.5 90 top
S30  SGND  [SGND]  156.5,39.5 180 top
S31  SGND  [SGND]  140.5,3.5 270 top
S35  SGND  [SGND]  38.5,41.5 90 top
S36  SGND  [SGND]  38.5,31 90 top
S37  SGND  [SGND]  104.5,40.5 180 top
S38  SGND  [SGND]  99,43.5 90 top
S39  SGND  [SGND]  99,55 90 top
S40  SGND  [SGND]  120,55.5 90 top
S43  SGND  [SGND]  144.5,39.5 0 top
SH1  SHUNT,0.1IN  [NOPACKAGE]  -1,0 0 top
SH2  SHUNT,0.1IN  [NOPACKAGE]  -1,3 0 top
SH3  SHUNT,0.1IN  [NOPACKAGE]  -1,2 0 top
SP1  SCOPE_PAD  [SCOPE_PAD]  148.6,103 180 top
SP2  SCOPE_PAD  [SCOPE_PAD]  114,132 90 top
SP3  SCOPE_PAD  [SCOPE_PAD]  82,80.5 270 top
SP4  SCOPE_PAD  [SCOPE_PAD]  13,120.5 90 top
SP5  SCOPE_PAD  [SCOPE_PAD]  134,108 180 top
SP6  SCOPE_PAD  [SCOPE_PAD]  76,62 270 top
SP7  SCOPE_PAD  [SCOPE_PAD]  107,74 90 top
SP8  SCOPE_PAD  [SCOPE_PAD]  107,69 90 top
SP9  SCOPE_PAD  [SCOPE_PAD]  141.5,149 0 top
SW1  TS-02B  [TS-02B]  123.23,130.12 90 top
SW2  SW-LC2259  [SW-LC2259]  13,51.5 0 top
SW3  TS-026  [TS-026]  2,84.86 90 top
SW4  TS-026  [TS-026]  2,92.01 90 top
SW5  SW-LC2259EENP  [SW-LC2259]  13,151.5 0 top
U1  STM32F405VGT6  [LQFP100-14]  93,117 90 top
U2  STMPS2141  [SOT23-5L]  143.5,130 90 top
U3  EMIF02-USB03F2  [ECOPACK-11]  148.17,129.92 90 top
U4  DNL  [SOIC8]  72.5,129.5 0 top
U5  L78M09  [DPAK]  71.5,143.5 0 top
U6  LD1117AS-33  [SOT223]  90.5,149 90 top
U7  LMV341  [SOT23-6]  47,113 90 top
U8  LD1117AS-33  [SOT223]  110,149 90 top
U9  TPS54329E  [PSO-DDA]  46.5,143.5 270 top
U10  LM386M-1  [SO08]  44.41,128.14 0 top
U11  ADE-1  [ADE-1]  49.5,52 0 top
U12  PGA-103+  [DF782]  91,39.5 270 top
U13  LMV341  [SOT23-6]  127.5,110.5 0 top
U14  SI5351A  [MSOP10]  91.5,69 180 top
U15  SI570  [SI570]  83.5,69 270 top
U16  SA612A  [SO-08]  130,88.5 90 top
X1  BU-SMA-H  [BU-SMA-H]  154.5,34 0 top
XTAL1  8.000MHz  [CTS-405]  112.5,115.5 270 top
XTAL2  25.000MHz  [CTS-405]  98,74 0 top
XTAL3  ECS-10.7-15B  [HC49U]  74.5,93 180 top
XTAL4  ECS-10.7-15B  [HC49U]  86.5,93 0 top